# EAGLE schematic schema (EAGLE 7.3.0)
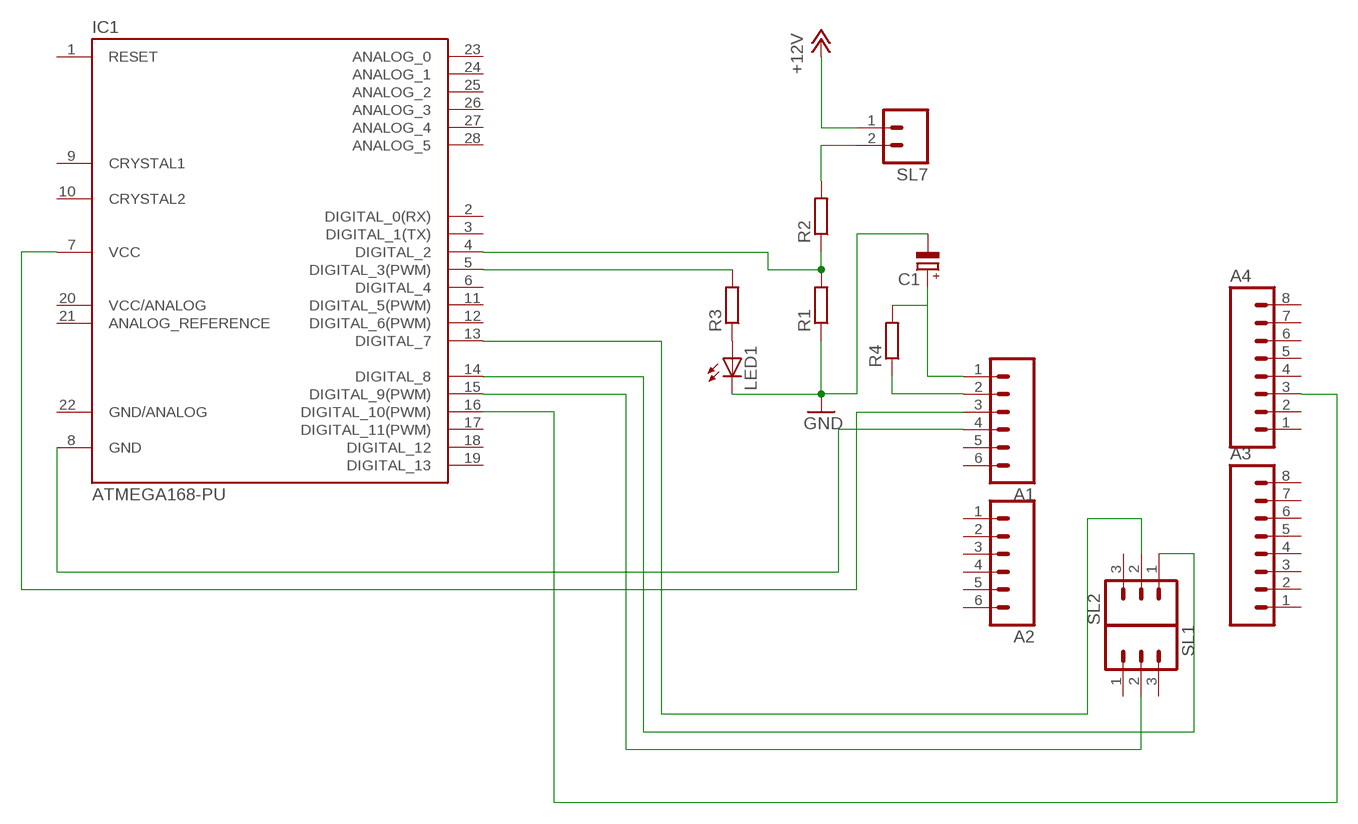
[diagram p0: schematic, sheet 1]

## Parts
A1  M06  [06P]
A2  M06  [06P]
A3  M08  [08P]
A4  M08  [08P]
C1  CPOL-EUE2,5-6E  [E2,5-6E]
IC1  ATMEGA168-PU  [DIL28-3]
LED1  LED3MM  [LED3MM]
R1  R-EU_0207/7  [0207/7]
R2  R-EU_0207/7  [0207/7]
R3  R-EU_0207/7  [0207/7]
R4  R-EU_0207/7  [0207/7]
SL1  M03  [03P]
SL2  M03  [03P]
SL7  M02  [02P]

## Nets
+12V: SL7.1
GND: C1.- LED1.K(C) R1.1
N$1: A4.3 IC1.16(DIGITAL_10(PWM))
N$2: IC1.15(DIGITAL_9(PWM)) SL1.2
N$3: IC1.14(DIGITAL_8) SL2.1
N$4: IC1.13(DIGITAL_7) SL2.2
N$5: A1.3 IC1.7(VCC)
N$6: A1.4 IC1.8(GND)
N$7: IC1.4(DIGITAL_2) R1.2 R2.1
N$8: A1.1 C1.+ R4.2
N$9: R2.2 SL7.2
N$10: LED1.A R3.1
N$12: IC1.5(DIGITAL_3(PWM)) R3.2
N$13: A1.2 R4.1
Unconnected: A1.5 A1.6 A2.1 A2.2 A2.3 A2.4 A2.5 A2.6 A3.1 A3.2 A3.3 A3.4 A3.5 A3.6 A3.7 A3.8 A4.1 A4.2 A4.4 A4.5 A4.6 A4.7 A4.8 IC1.1(RESET) IC1.2(DIGITAL_0(RX)) IC1.3(DIGITAL_1(TX)) IC1.6(DIGITAL_4) IC1.9(CRYSTAL1) IC1.10(CRYSTAL2) IC1.11(DIGITAL_5(PWM)) IC1.12(DIGITAL_6(PWM)) IC1.17(DIGITAL_11(PWM)) IC1.18(DIGITAL_12) IC1.19(DIGITAL_13) IC1.20(VCC/ANALOG) IC1.21(ANALOG_REFERENCE) IC1.23(ANALOG_0) IC1.24(ANALOG_1) IC1.25(ANALOG_2) IC1.26(ANALOG_3) IC1.27(ANALOG_4) IC1.28(ANALOG_5) SL1.1 SL1.3 SL2.3

## Power pins joined to a net without a drawn wire
GND/ANALOG: IC1.22(GND/ANALOG)

## Library data of the parts
A1 A2 = con-amp-quick:M06: AMP QUICK CONNECTOR; OC_FARNELL: unknown; OC_NEWARK: unknown
A3 A4 = con-amp-quick:M08: AMP QUICK CONNECTOR; OC_FARNELL: unknown; OC_NEWARK: unknown
C1 = rcl:CPOL-EU: POLARIZED CAPACITOR, European symbol
IC1 = Arduino-AVR:ATMEGA168-PU
LED1 = led:LED: LED OSRAM: - CHIPLED LG R971, LG N971, LY N971, LG Q971, LY Q971, LO R971, LY R971 LH N974, LH R974 LS Q976, LO Q976, LY Q976 LO Q996 - Hyper CHIPLED LW Q18S LB Q993, LB Q99A, LB R99A - SideLED LS A670, LO A670, LY A670, LG A670, LP A670 LB A673, LV A673, LT A673, LW A673 LH A674 LY A675 LS A676, LA A676, LO A676, LY A676, LW A676 LS A679, LY A679, LG A679 - Hyper Micro SIDELED® LS Y876, LA Y876, LO Y876, LY Y876 LT Y87S - SmartLED LW L88C, LW L88S LB L89C, LB L89S, LG L890 LS L89K, LO L89K, LY L89K LS L896, LA L896, LO L896, LY L896 - TOPLED LS T670, LO T670, LY T670, LG T670, LP T670 LSG T670, LSP T670, LSY T670, LOP T670, LYG T670 LG T671, LOG T671, LSG T671 LB T673, LV T673, LT T673, LW T673 LH T674 LS T676, LA T676, LO T676, LY T676, LB T676, LH T676, LSB T676, LW T676 LB T67C, LV T67C, LT T67C, LS T67K, LO T67K, LY T67K, LW E67C LS E67B, LA E67B, LO E67B, LY E67B, LB E67C, LV E67C, LT E67C LW T67C LS T679, LY T679, LG T679 LS T770, LO T770, LY T770, LG T770, LP T770 LB T773, LV T773, LT T773, LW T773 LH T774 LS E675, LA E675, LY E675, LS T675 LS T776, LA T776, LO T776, LY T776, LB T776 LHGB T686 LT T68C, LB T68C - Hyper Mini TOPLED® LB M676 - Mini TOPLED Santana® LG M470 LS M47K, LO M47K, LY M47K Source: http://www.osram.convergy.de LUXEON: - LUMILED® LXK2-PW12-R00, LXK2-PW12-S00, LXK2-PW14-U00, LXK2-PW14-V00 LXK2-PM12-R00, LXK2-PM12-S00, LXK2-PM14-U00 LXK2-PE12-Q00, LXK2-PE12-R00, LXK2-PE12-S00, LXK2-PE14-T00, LXK2-PE14-U00 LXK2-PB12-K00, LXK2-PB12-L00, LXK2-PB12-M00, LXK2-PB14-N00, LXK2-PB14-P00, LXK2-PB14-Q00 LXK2-PR12-L00, LXK2-PR12-M00, LXK2-PR14-Q00, LXK2-PR14-R00 LXK2-PD12-Q00, LXK2-PD12-R00, LXK2-PD12-S00 LXK2-PH12-R00, LXK2-PH12-S00 LXK2-PL12-P00, LXK2-PL12-Q00, LXK2-PL12-R00 Source: www.luxeon.com KINGBRIGHT: KA-3528ASYC Source: www.kingbright.com
R1-R4 = resistor:R-EU_: RESISTOR, European symbol
SL1 SL2 = con-amp-quick:M03: AMP QUICK CONNECTOR; OC_FARNELL: unknown; OC_NEWARK: unknown
SL7 = con-amp-quick:M02: AMP QUICK CONNECTOR; OC_FARNELL: unknown; OC_NEWARK: unknown